# EasyEDA Pro project PCI_trifasico.epro

# Schematic Schematic2
Board Name: Schematic2; Create Date: 2025-02-21; Page Name: P1; Project Name: PCB_trifasico; Schematic Name: Schematic2; Update Date: 2025-02-21; Company: EasyEDA.com; Page Size: A4; Version: V1.0
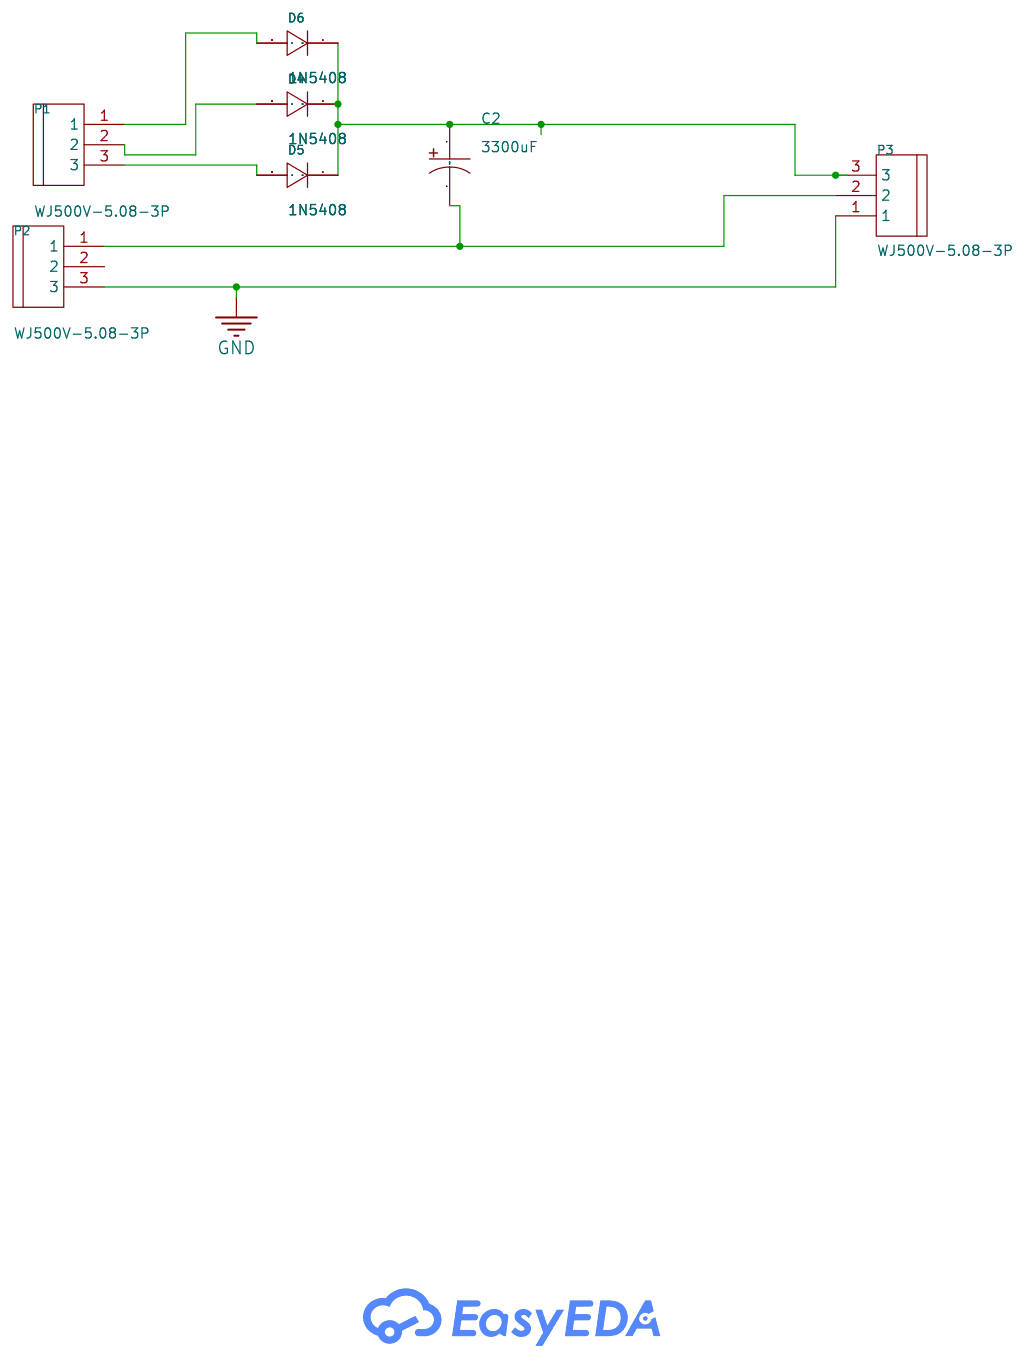
[diagram p0: schematic sheet]

## Parts
C2  3300uF  [CAP-TH_BD40.0-P10.00-D2.3-FD]
D4  1N5408  [DO-201_BD5.3-L9.5-P13.50-D1.4-RD]
D5  1N5408  [DO-201_BD5.3-L9.5-P13.50-D1.4-RD]
D6  1N5408  [DO-201_BD5.3-L9.5-P13.50-D1.4-RD]
P1  WJ500V-5.08-3P  [CONN-TH_3P-P5.00_WJ500V-5.08-3P]
P2  WJ500V-5.08-3P  [CONN-TH_3P-P5.00_WJ500V-5.08-3P]
P3  WJ500V-5.08-3P  [CONN-TH_3P-P5.00_WJ500V-5.08-3P]

## Library data of the parts
C2 = RP2G561MT350S68CE0: Capacitance: Tolerance:±20% Tolerance:±20% Rated Voltage: Lead Spacing: Equivalent Series Resistance (ESR):- Ripple Current:- φD: L: Lifetime @ Temperature:2000hrs@105℃ Operating Temperature:-25℃~+105℃ Operating Temperature:-25℃~+105℃; LCSC Part Name: 560uF ±20% 400V; Supplier Part: C240476; Manufacturer: HUAWEI(华威集团); Supplier Footprint: 插件,D40xL35mm; JLCPCB Part Class: Extended Part; Datasheet: https://atta.szlcsc.com/upload/public/pdf/source/20180730/C240476_1EFDEDE985143EC11B6638D9160DF286.pdf; Supplier: LCSC; Tolerance: ±20%; Lifetime @ Temperature: 2000hrs@105℃; Operating Temperature: -25℃~+105℃
D4-D6 = 1N5408_C82807: Diode Configuration: Forward Voltage (Vf@If):1.2V@3A Reverse Voltage (Vr): Average Rectified Current (Io): Reverse Leakage Current:5uA@1kV; LCSC Part Name: 电压:1kV 电流:3A; Supplier Part: C82807; Manufacturer: LRC(乐山无线电); Supplier Footprint: DO-201AD; JLCPCB Part Class: Extended Part; Datasheet: https://atta.szlcsc.com/upload/public/pdf/source/20161024/1477288469472.pdf; Supplier: LCSC; Forward Voltage (Vf@If): 1.2V@3A; Reverse Leakage Current: 5uA@1kV
P1-P3 = WJ500V-5.08-3P: Structure:1x3P Pitch:5.08mm Color:Green Mounting Style:Straight Current Rating (Max):18A Voltage Rating (Max):250V Number of Pins:3P Number of Rows:1 Wire Gauge - AWG:14~30 Wire Gauge - AWG:14~30 Wire Gauge - mm2:2.5 Wire Gauge - mm2:2.5 Number of PINs Pe; LCSC Part Name: 5.08mm 1x3P 排数:1 每排P数:3 直插; Supplier Part: C72334; Manufacturer: KANGNEX(康奈克斯电气); Supplier Footprint: 插件,P=5.08mm; JLCPCB Part Class: Extended Part; Datasheet: https://atta.szlcsc.com/upload/public/pdf/source/20191225/C72334_8A5EF831D67650233B6B1E3F2BC06274.pdf; Supplier: LCSC; Structure: 1x3P; Pitch: 5.08mm; Color: Green; Mounting Style: Straight; Current Rating (Max): 18A; Voltage Rating (Max): 250V; Number of Pins: 3P; Number of Rows: 1; Wire Gauge - AWG: 14~30; Wire Gauge - mm2: 2.5; Number of PINs Per Row: 3; Operating Temperature Range: -40℃~+105℃

## Nets
GND: P2.3 P3.1
$1N238: C2.1 D4.1(C) D5.1(C) D6.1(C) P3.3
$1N689: D6.2(A) P1.1
$1N696: D4.2(A) P1.2
$1N704: D5.2(A) P1.3
$1N833: C2.2 P2.1 P3.2

Not connected (* = marked no-connect by the designer): P2 2

# Board PCB_trifasico
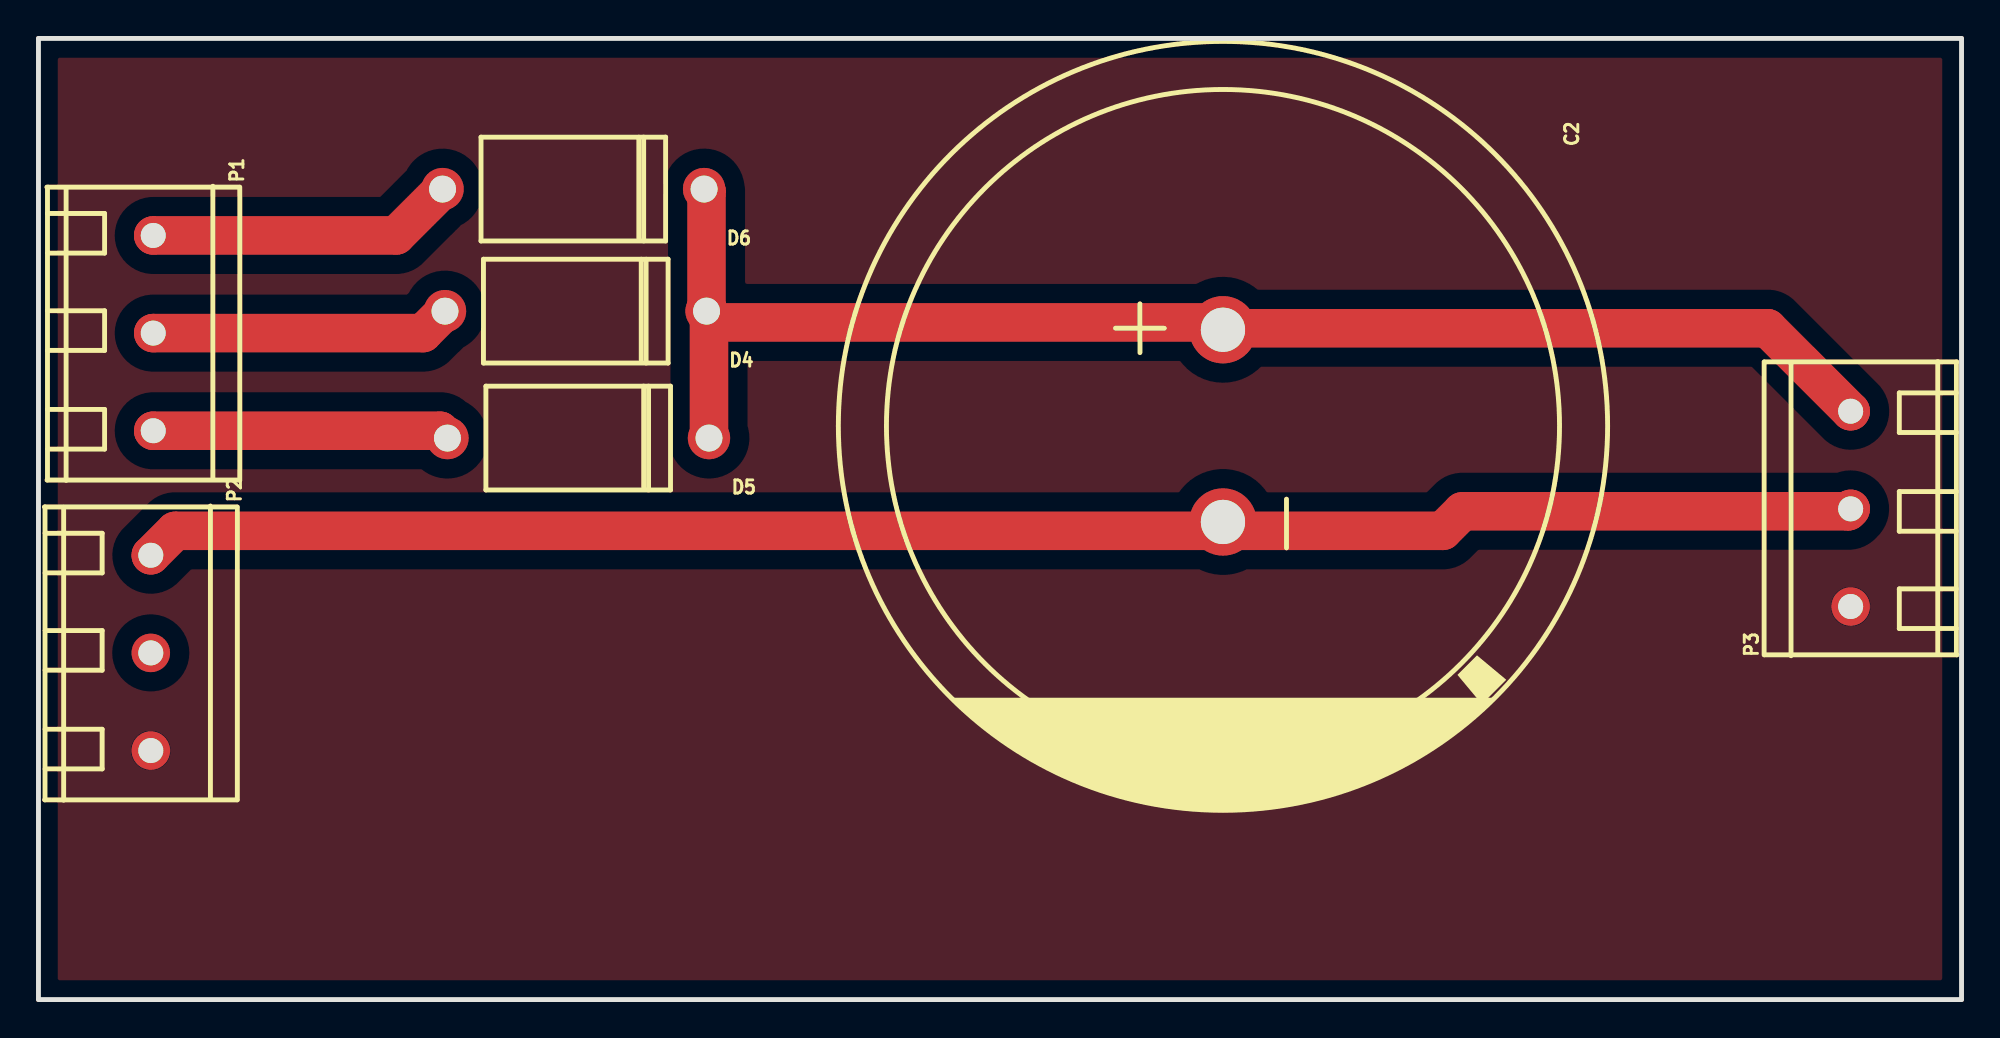
[diagram p1: board, top side]
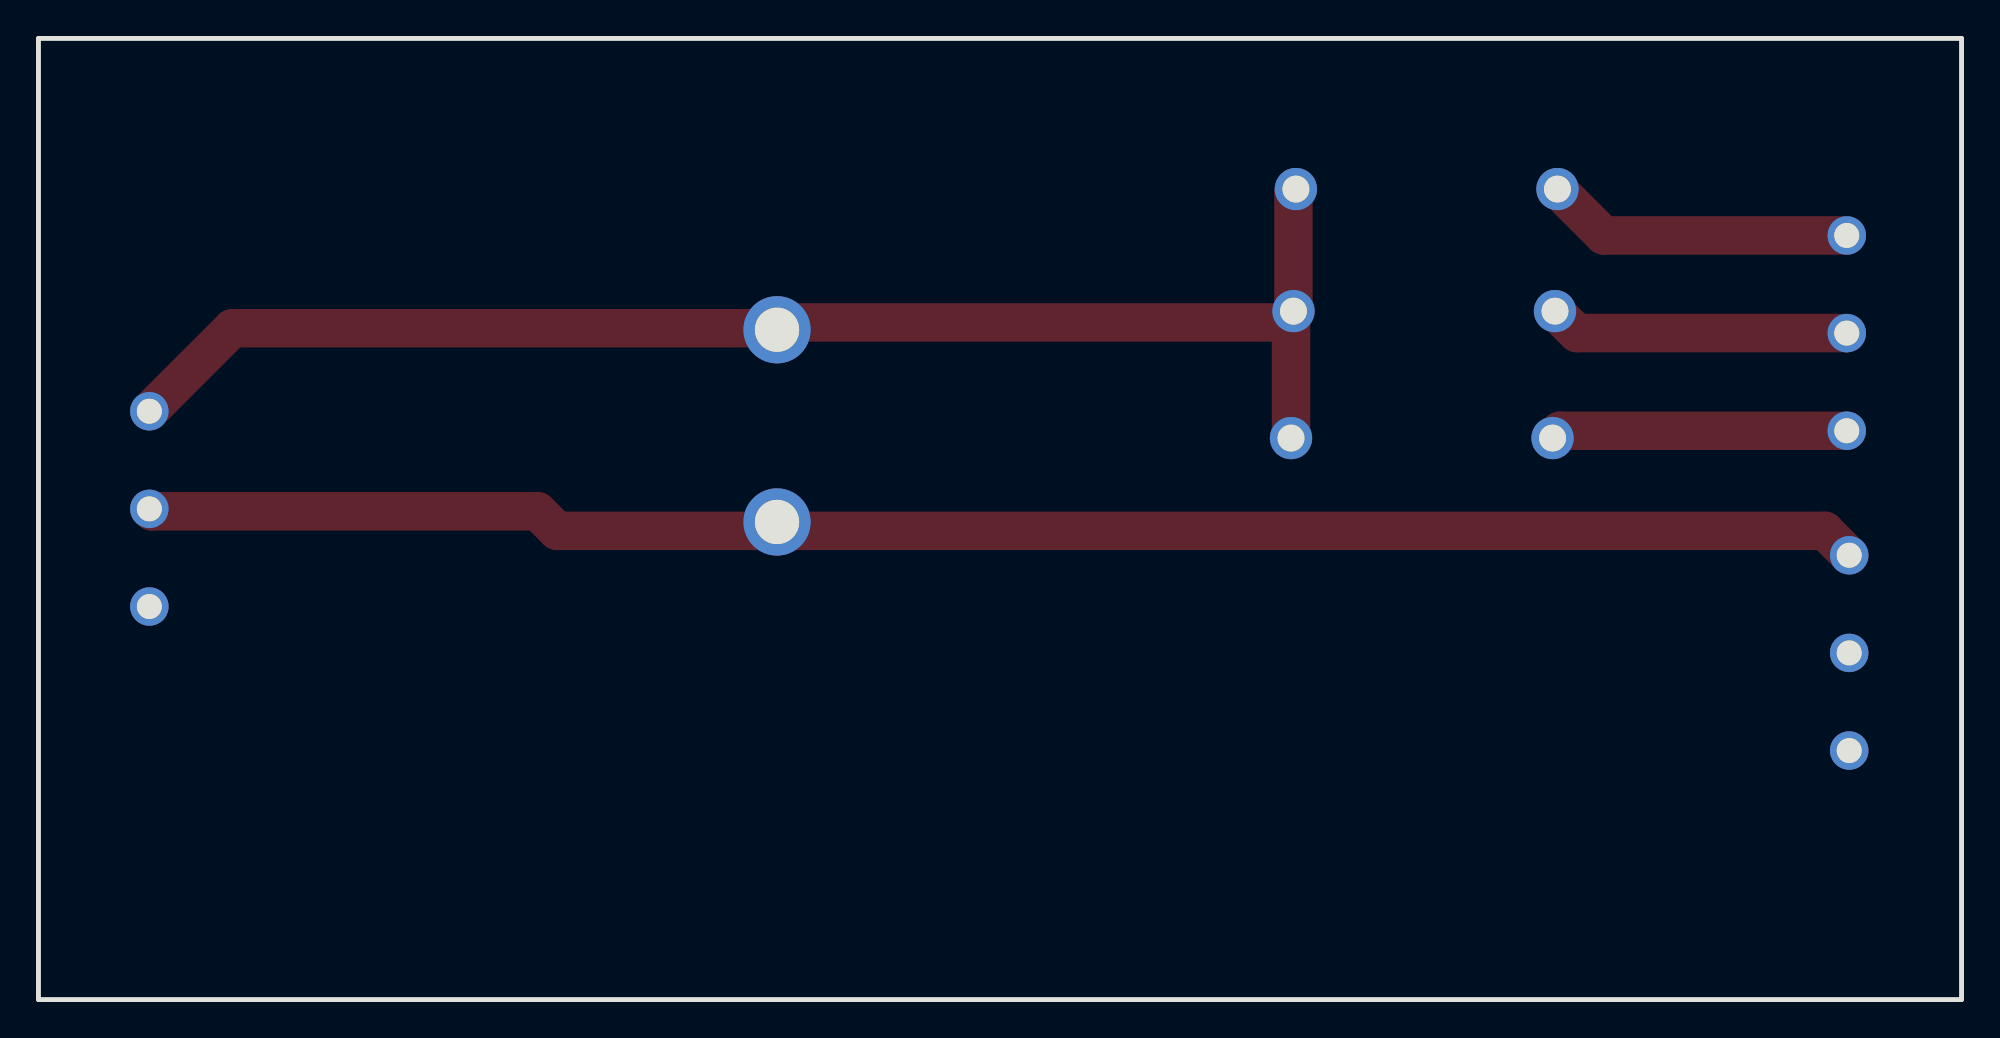
[diagram p2: board, bottom side, seen from below]

Outline 100 x 50 mm; copper layers: Top Layer, Bottom Layer. Coordinates in mm from the lower left corner of the outline.
Outline path: 0,50 100,50 100,0 0,0 0,50
Stack: Top Layer 0.035mm / Dielectric1 1.51mm FR4 er 4.5 / Bottom Layer 0.035mm

## Design rules (mm)
template: User Custom Config
spacing Default (default): track to track 0.152, other pairs 0 to 0.152
track width Default (default): min 0.254, default 0.254, max 25.4
differential pair differentialPair (default): width min 0.127, default 0.254, max 2.54; gap min 0.152, default 0.152
via Default (default): diameter min 0.61, default 0.61, max 100.025; hole min 0.305, default 0.305, max 59.995

## Placement (name value [footprint] x y rotation side)
C2  3300uF  [CAP-TH_BD40.0-P10.00-D2.3-FD]  61.59 29.84 270 top
D4  1N5408  [DO-201_BD5.3-L9.5-P13.50-D1.4-RD]  27.94 35.81 180 top
D5  1N5408  [DO-201_BD5.3-L9.5-P13.50-D1.4-RD]  28.07 29.21 180 top
D6  1N5408  [DO-201_BD5.3-L9.5-P13.50-D1.4-RD]  27.81 42.16 180 top
P1  WJ500V-5.08-3P  [CONN-TH_3P-P5.00_WJ500V-5.08-3P]  5.97 34.67 270 top
P2  WJ500V-5.08-3P  [CONN-TH_3P-P5.00_WJ500V-5.08-3P]  5.84 18.03 270 top
P3  WJ500V-5.08-3P  [CONN-TH_3P-P5.00_WJ500V-5.08-3P]  94.23 25.53 90 top

## Footprints (pads in the part's own frame, mm; a bottom-side part is the same pattern mirrored in y, then rotated)
CAP-TH_BD40.0-P10.00-D2.3-FD
  round 3.5 hole 2.3: 1(-5,0) 2(5,0)
CONN-TH_3P-P5.00_WJ500V-5.08-3P
  round 2 hole 1.3: 1(-5.08,0) 2(0,0) 3(5.08,0)
DO-201_BD5.3-L9.5-P13.50-D1.4-RD
  round 2.2 hole 1.4: 1(-6.8,0) 2(6.8,0)

## Nets
As in the schematic.

Pads without a net: P2 2

## Routing (per net, layer and track width the routed paths; a pad name or vN(x,y) marks a point on that pad's centre or on a via; arc(x,y) is an arc through that point)
$1N238: length 74.3
  Top Layer w2: D5.1 34.87,35.23 ; 34.87,35.23 61.59,35.23 61.9,34.92 89.92,34.92 P3.3 ; 34.87,35.23 34.87,35.69 D4.1 34.74,42.04 D6.1
$1N689: length 16
  Top Layer w2: D6.2 18.6,39.75 P1.1
$1N696: length 15.6
  Top Layer w2: D4.2 20,34.67 P1.2
$1N704: length 15.5
  Top Layer w2: D5.2 20.89,29.59 P1.3
$1N833: length 89.4
  Top Layer w2: P3.2 94.11,25.4 74.04,25.4 73.03,24.38 7.11,24.38 P2.1

## Copper pours and planes (outline as drawn; the poured copper is in the pictures)
GND on Top Layer: 0,49.75 100,49.75 100,-0.25 0,-0.25

## Text on the board
Document Layer: Data de Emissão: 20/02/2025 / Equipe Técnica: Paulo G. L. Xavier, João P. F. da Silva / Tipo de Documento: Retificador 3 pulso trifásico / Número de Identificação: EP_2024_2-G / Revisado por: Paulo G. L. Xavier, João P. F. da Silva / Data da Revisão: 21/02/2025 / Versão do Projeto: 2024_2_rev1
